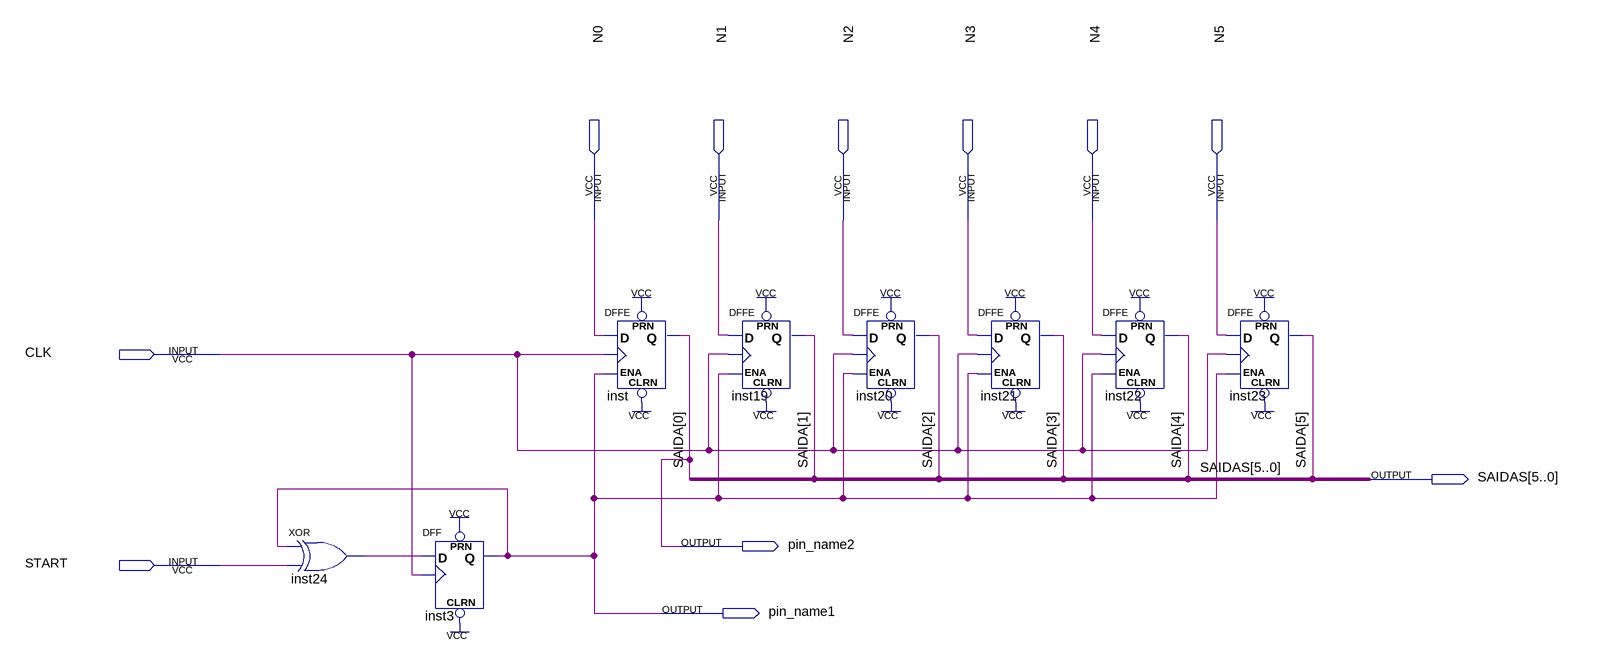
[diagram p0: schematic sheet]
// Quartus schematic memoria.bdf as structural Verilog: 8 symbols, 11 pins
module memoria (
  input  N0,
  input  N1,
  input  N2,
  input  N3,
  input  N4,
  input  N5,
  input  CLK,
  input  START,
  output [5:0] SAIDAS,
  output pin_name2,
  output pin_name1
);

  wire inst24_out;
  wire [5:1] SAIDA;

  xor inst24 (inst24_out, pin_name1, START);
  DFF inst3 (.CLRN(1'b1), .CLK(CLK), .D(inst24_out), .PRN(1'b1), .Q(pin_name1));
  DFFE inst (.PRN(1'b1), .CLRN(1'b1), .D(N0), .CLK(CLK), .ENA(pin_name1), .Q(pin_name2));
  DFFE inst19 (.PRN(1'b1), .CLRN(1'b1), .D(N1), .CLK(CLK), .ENA(pin_name1), .Q(SAIDA[1]));
  DFFE inst20 (.PRN(1'b1), .CLRN(1'b1), .D(N2), .CLK(CLK), .ENA(pin_name1), .Q(SAIDA[2]));
  DFFE inst21 (.PRN(1'b1), .CLRN(1'b1), .D(N3), .CLK(CLK), .ENA(pin_name1), .Q(SAIDA[3]));
  DFFE inst22 (.PRN(1'b1), .CLRN(1'b1), .D(N4), .CLK(CLK), .ENA(pin_name1), .Q(SAIDA[4]));
  DFFE inst23 (.PRN(1'b1), .CLRN(1'b1), .D(N5), .CLK(CLK), .ENA(pin_name1), .Q(SAIDA[5]));

  // Other names for the same wires on the sheet: SAIDA[0] = pin_name2
endmodule
